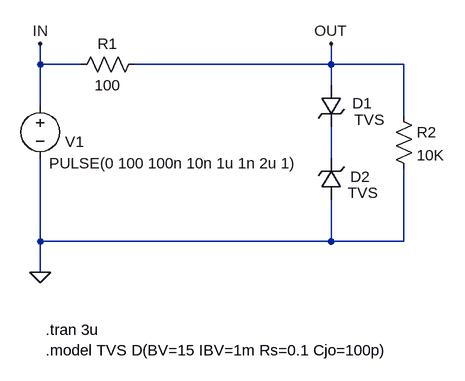
[diagram p0: schematic v1.0.asc]
v1.0.asc, the LTspice schematic file:
Version 4.1
SHEET 1 880 680
WIRE 32 80 32 48
WIRE 96 80 32 80
WIRE 480 80 480 48
WIRE 480 80 176 80
WIRE 592 80 480 80
WIRE 480 112 480 80
WIRE 32 144 32 80
WIRE 592 160 592 80
WIRE 480 224 480 176
WIRE 32 352 32 224
WIRE 480 352 480 288
WIRE 480 352 32 352
WIRE 592 352 592 240
WIRE 592 352 480 352
WIRE 32 400 32 352
FLAG 32 400 0
FLAG 480 48 OUT
FLAG 32 48 IN
SYMBOL voltage 32 128 R0
WINDOW 0 38 71 Left 2
WINDOW 3 14 104 Left 2
WINDOW 123 0 0 Left 0
WINDOW 39 0 0 Left 0
SYMATTR InstName V1
SYMATTR Value PULSE(0 100 100n 10n 1u 1n 2u 1)
SYMBOL res 192 64 R90
WINDOW 0 0 56 VBottom 2
WINDOW 3 32 56 VTop 2
SYMATTR InstName R1
SYMATTR Value 100
SYMBOL zener 464 112 R0
WINDOW 0 49 28 Left 2
WINDOW 3 52 53 Left 2
SYMATTR InstName D1
SYMATTR Value TVS
SYMBOL zener 496 288 R180
WINDOW 0 -44 35 Left 2
WINDOW 3 -56 11 Left 2
SYMATTR InstName D2
SYMATTR Value TVS
SYMBOL res 576 144 R0
SYMATTR InstName R2
SYMATTR Value 10K
TEXT 40 488 Left 2 !.tran 3u
TEXT 40 520 Left 2 !.model TVS D(BV=15 IBV=1m Rs=0.1 Cjo=100p)

The netlist it stands for:
* v1.0.asc
V1 IN 0 PULSE(0 100 100n 10n 1u 1n 2u 1)
R1 OUT IN 100
D1 OUT N001 TVS
D2 0 N001 TVS
R2 OUT 0 10K
.model D D
.lib standard.dio
.tran 3u
.model TVS D(BV=15 IBV=1m Rs=0.1 Cjo=100p)
.backanno
.end